# Altium schematic sheet Connectors.SchDoc
size A4
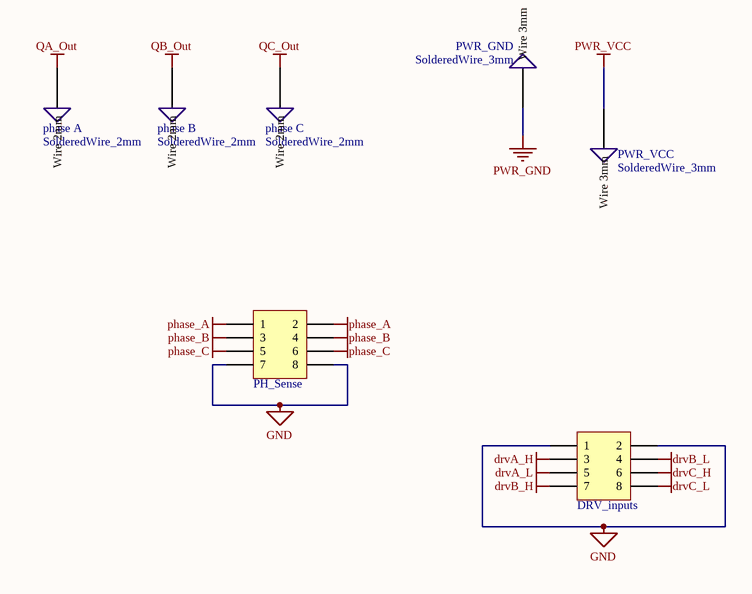
[diagram p0: Connectors.SchDoc]

## Parts
DRV_inputs  HEADER-4x2S  [G-HEADER_4x2I.1P_TH]  (value not drawn)
PH_Sense  HEADER-4x2S  [G-HEADER_4x2I.1P_TH]  (value not drawn)
phase_A  SolderedWire_2mm  [2MM_PAD]
phase_B  SolderedWire_2mm  [2MM_PAD]
phase_C  SolderedWire_2mm  [2MM_PAD]
PWR_GND  SolderedWire_3mm  [3MM_PAD]
PWR_VCC  SolderedWire_3mm  [3MM_PAD]

## Nets
drvA_H: DRV_inputs.3
drvA_L: DRV_inputs.5
drvB_H: DRV_inputs.7
drvB_L: DRV_inputs.4
drvC_H: DRV_inputs.6
drvC_L: DRV_inputs.8
GND: DRV_inputs.1 DRV_inputs.2 PH_Sense.7 PH_Sense.8
phase_A: PH_Sense.1 PH_Sense.2
phase_B: PH_Sense.3 PH_Sense.4
phase_C: PH_Sense.5 PH_Sense.6
PWR_GND: PWR_GND.0(Wire_3mm)
PWR_VCC: PWR_VCC.0(Wire_3mm)
QA_Out: phase_A.0(Wire_2mm)
QB_Out: phase_B.0(Wire_2mm)
QC_Out: phase_C.0(Wire_2mm)

## Notes on the sheet
- Title
- Size:
- Date:
- A4
- Number:
- Time:
- Revision:
- Sheet
- of
- File:
- Drawn by:

## Library data of the parts
DRV_inputs PH_Sense = HEADER_4x2_100mil_F: CONN HEADER FMAL 8PS .1" DL GOLD; Name: HEADER_4x2_100mil_F; Supplier 1: SyC; Supplier Part Number 1: PB08D-H
phase_A phase_B phase_C = SOLDERED_WIRE_2mm: Pad to solder wire; Name: SOLDERED_WIRE_2mm
PWR_GND PWR_VCC = SOLDERED_WIRE_3mm: Pad to solder wire; Name: SOLDERED_WIRE_3mm